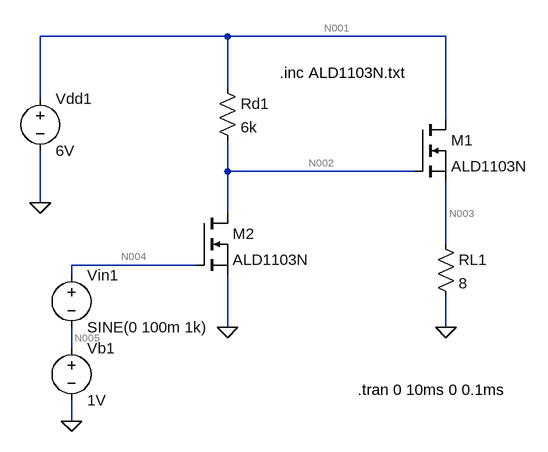
[diagram p0: schematic Draft2.asc]
Draft2.asc, the LTspice schematic file:
Version 4.1
SHEET 1 936 680
WIRE 32 -144 -256 -144
WIRE 368 -144 32 -144
WIRE 32 -64 32 -144
WIRE -256 -48 -256 -144
WIRE 368 -16 368 -144
WIRE 32 64 32 16
WIRE 320 64 32 64
WIRE -256 112 -256 32
WIRE 32 128 32 64
WIRE 368 176 368 80
WIRE -16 208 -208 208
WIRE -208 224 -208 208
WIRE 32 304 32 224
WIRE 368 304 368 256
WIRE -208 336 -208 304
WIRE -208 448 -208 416
FLAG -256 112 0
FLAG 368 304 0
FLAG 32 304 0
FLAG -208 448 0
SYMBOL voltage -256 -64 R0
WINDOW 123 0 0 Left 0
WINDOW 39 0 0 Left 0
SYMATTR InstName Vdd1
SYMATTR Value 6V
SYMBOL res 16 -80 R0
SYMATTR InstName Rd1
SYMATTR Value 6k
SYMBOL res 352 160 R0
SYMATTR InstName RL1
SYMATTR Value 8
SYMBOL nmos 320 -16 R0
SYMATTR InstName M1
SYMATTR Value ALD1103N
SYMBOL nmos -16 128 R0
SYMATTR InstName M2
SYMATTR Value ALD1103N
SYMBOL voltage -208 208 R0
WINDOW 123 0 0 Left 0
WINDOW 39 0 0 Left 0
SYMATTR InstName Vin1
SYMATTR Value SINE(0 100m 1k)
SYMBOL voltage -208 320 R0
WINDOW 123 0 0 Left 0
WINDOW 39 0 0 Left 0
SYMATTR InstName Vb1
SYMATTR Value 1V
TEXT 112 -88 Left 2 !.inc ALD1103N.txt
TEXT 232 400 Left 2 !.tran 0 10ms 0 0.1ms

The netlist it stands for:
* Draft2.asc
Vdd1 N001 0 6V
Rd1 N001 N002 6k
RL1 N003 0 8
M1 N001 N002 N003 N003 ALD1103N
M2 N002 N004 0 0 ALD1103N
Vin1 N004 N005 SINE(0 100m 1k)
Vb1 N005 0 1V
.model NMOS NMOS
.model PMOS PMOS
.lib standard.mos
.inc ALD1103N.txt
.tran 0 10ms 0 0.1ms
.backanno
.end

* Results of the author's LTspice run, read from the files saved beside the schematic
* Operating Point, zero values left out:
*   V(n002) = 3.235 V
*   V(n004) = 1 V
*   V(n005) = 1 V
*   V(n001) = 6 V
*   V(n003) = 135.3 mV
*   I(Vdd1) = -17.37 mA
*   I(RL1) = 16.91 mA
*   Id(M2) = 460.8 µA
*   Is(M2) = -460.8 µA
*   Ib(M2) = -3.245 pA
*   I(Rd1) = 460.8 µA
*   Id(M1) = 16.91 mA
*   Is(M1) = -16.91 mA
*   Ib(M1) = -5.879 pA
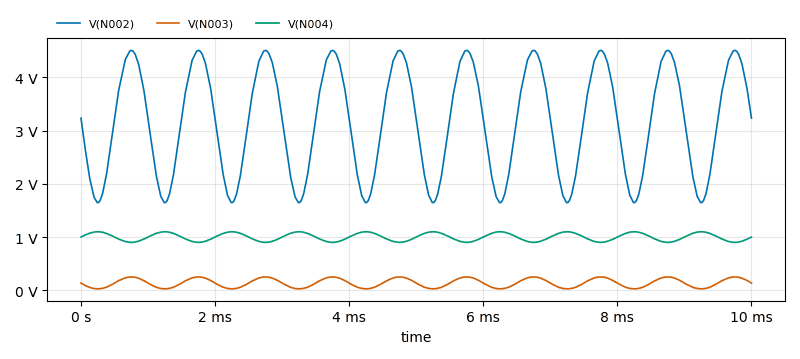
[diagram p1: Transient Analysis of Draft2.asc, plotted from the saved traces]
* Transient Analysis, 1 run:
*   V(N002): min 1.646 V, max 4.51 V, average 3.153 V, rms 3.317 V, last 3.235 V
*   V(N003): min 27.19 mV, max 250.8 mV, average 136.8 mV, rms 159.2 mV, last 135.3 mV
*   V(N004): min 900.1 mV, max 1.1 V, average 1 V, rms 1.003 V, last 1 V